# Altium schematic sheet Sheet_1_2021-06-06.schdoc
size 231 x 139 mm
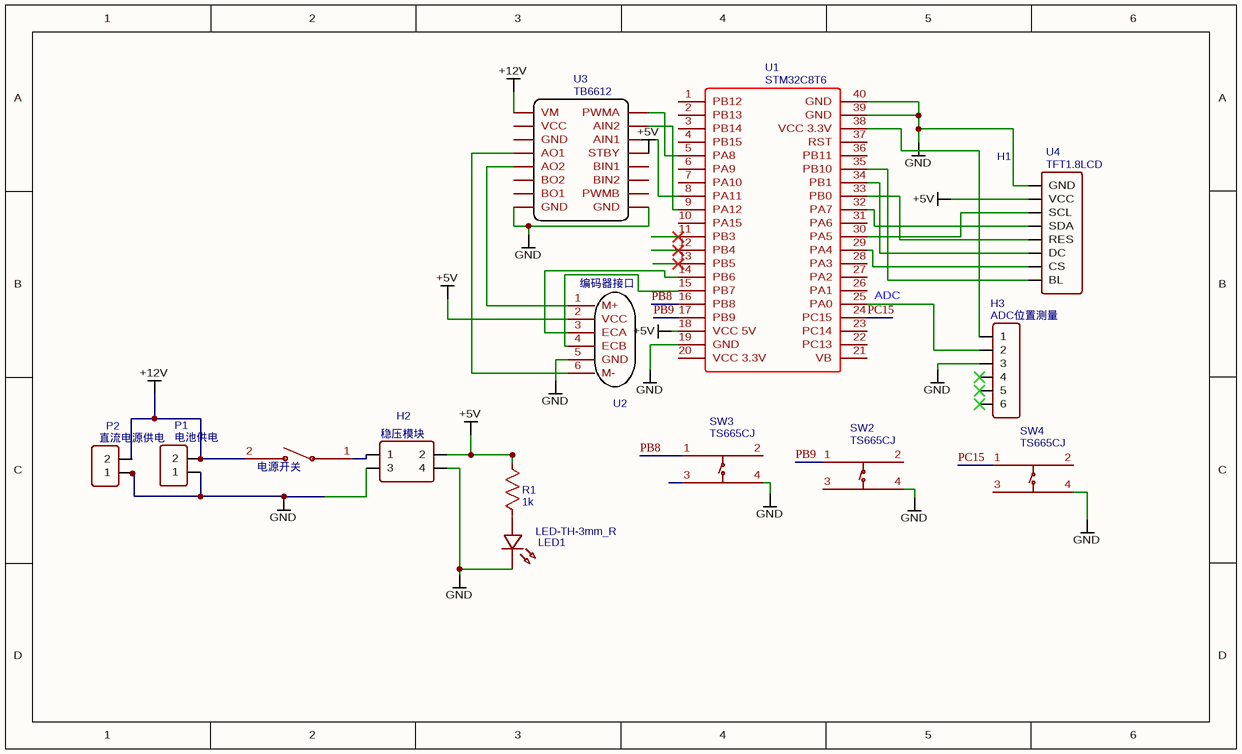
[diagram p0: Sheet_1_2021-06-06.schdoc]

## Parts
?  电源开关  [SW-TH_SDDJE10700]
H2  稳压模块  [XL4015]
H3  ADC位置测量  [HDR-F-2.54_1X6]
LED1  LED-TH-3mm_R  [LED-TH_BD3.0_RED]
P1  电池供电  [CONN-TH_2P-P5.00]
P2  直流电源供电  [CONN-TH_2P-P5.00]
R1  1k  [R_AXIAL-0.8]
SW2  TS665CJ  [SW-TH_4P-L6.0-W6.0-P4.50-LS6.5]
SW3  TS665CJ  [SW-TH_4P-L6.0-W6.0-P4.50-LS6.5]
SW4  TS665CJ  [SW-TH_4P-L6.0-W6.0-P4.50-LS6.5]
U1  STM32C8T6  [PCBComponent_1 - duplicate]
U2  编码器接口  [HDR-F-2.54_1X6]
U3  TB6612  [TB6612]
U4  TFT1.8LCD  [HDR-F-2.54_1X8]

## Nets
+5V: H2.2 R1.2 U1.18(VCC_5V) U2.2(VCC) U3.12(STBY) U4.2(VCC)
+12V: ?.2 P1.2 P2.2 U3.1(VM)
GND: H2.3 H2.4 H3.3 LED1.2 P1.1 P2.1 SW2.4(D) SW3.4(D) SW4.4(D) U1.19(GND) U1.39(GND) U1.40(GND) U2.5(GND) U3.8(GND) U3.16(GND) U4.1(GND)
PB8: SW3.1(A) U1.16(PB8)
PB9: SW2.1(A) U1.17(PB9)
PC15: SW4.1(A) U1.24(PC15)
Net?_1: ?.1 H2.1
NetH3_1: H3.1 U1.38(VCC_3.3V)
NetH3_2: H3.2 U1.25(PA0)
NetLED1_1: LED1.1 R1.1
NetU1_5: U1.5(PA8) U3.9(PWMA)
NetU1_8: U1.8(PA11) U3.11(AIN1)
NetU1_9: U1.9(PA12) U3.10(AIN2)
NetU1_14: U1.14(PB6) U2.3(ECA)
NetU1_15: U1.15(PB7) U2.4(ECB)
NetU1_29: U1.29(PA4) U4.7(CS)
NetU1_30: U1.30(PA5) U4.3(SCL)
NetU1_32: U1.32(PA7) U4.4(SDA)
NetU1_33: U1.33(PB0) U4.5(RES)
NetU1_34: U1.34(PB1) U4.6(DC)
NetU1_35: U1.35(PB10) U4.8(BL)
NetU2_1: U2.1(M+) U3.5(AO2)
NetU2_6: U2.6(M-) U3.4(AO1)

Not connected (* = marked no-connect by the designer): H3 4* 5* 6*; SW2 2(B) 3(C); SW3 2(B) 3(C); SW4 2(B) 3(C); U1 1(PB12) 2(PB13) 3(PB14) 4(PB15) 6(PA9) 7(PA10) 10(PA15) 11(PB3)* 12(PB4)* 13(PB5)* 20(VCC_3.3V) 21(VB) 22(PC13) 23(PC14) 26(PA1) 27(PA2) 28(PA3) 31(PA6) 36(PB11) 37(RST); U3 2(VCC) 3(GND) 6(BO2) 7(BO1) 13(BIN1) 14(BIN2) 15(PWMB)

## Notes on the sheet
- (near U4) H1
- (near U1) ADC

## Library data of the parts
? = 电源开关: BOM_Manufacturer: ALPSALPINE(阿尔卑斯阿尔派); BOM_Manufacturer Part: SDDJE10700; Contributor: LCSC; BOM_Supplier: LCSC; BOM_Supplier Part: C358626; BOM_JLCPCB Part Class: Extended Part; spicePre: S; spiceSymbolName: SDDJE10700
H2 = 稳压模块: Contributor: LCEDA_Lib; BOM_Supplier Part: C239342; BOM_Supplier: LCSC; spicePre: H; spiceSymbolName: HDR-F-2.54_2x2
H3 = ADC位置测量: Contributor: LCEDA_Lib; BOM_Supplier Part: C40877; BOM_Supplier: LCSC; spicePre: H; spiceSymbolName: HDR-F-2.54_1x6
LED1 = LED-TH-3mm_R: BOM_Manufacturer: EVERLIGHT(台湾亿光); BOM_Manufacturer Part: 204-10SDRD/S530-A3-L; Contributor: LCEDA_Lib; BOM_Supplier Part: C84774; BOM_Supplier: LCSC; spicePre: L; spiceSymbolName: LED-TH-3mm_R
P1 = 电池供电: Contributor: LCEDA_Lib; BOM_Supplier: LCSC; spicePre: P; spiceSymbolName: CONN-TH_2P-P5.00
P2 = 直流电源供电: Contributor: LCEDA_Lib; BOM_Supplier: LCSC; spicePre: P; spiceSymbolName: CONN-TH_2P-P5.00
R1 = 1k: nameAlias: Value(Ω); Contributor: LCEDA_Lib; spicePre: R; spiceSymbolName: R_AXIAL-0.8_US
SW2-SW4 = TS665CJ: BOM_Manufacturer: SHOU HAN; Contributor: LCSC; BOM_Supplier: LCSC; BOM_Supplier Part: C393938; BOM_Manufacturer Part: TS665CJ; BOM_JLCPCB Part Class: Extended Part; spicePre: S; spiceSymbolName: TS665CJ
U1 = STM32C8T6: Contributor: control_youself; spicePre: U; spiceSymbolName: STM32C8T6
U2 = 编码器接口: Contributor: control_youself; spicePre: U; spiceSymbolName: 编码器接口
U3 = TB6612: Contributor: control_youself; spicePre: U; spiceSymbolName: TB6612
U4 = TFT1.8LCD: Contributor: control_youself; spicePre: U; spiceSymbolName: TFT1.8LCD